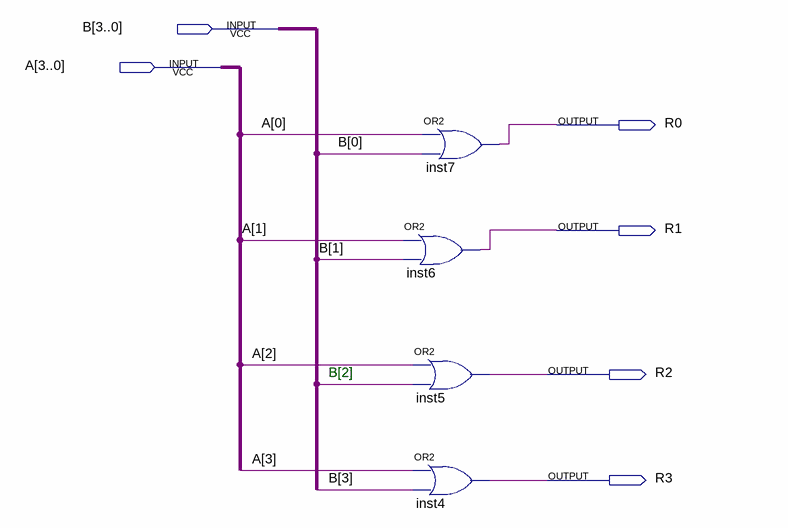
[diagram p0: schematic sheet]
// Quartus schematic ComOr.bdf as structural Verilog: 4 symbols, 6 pins
module ComOr (
  input  [3:0] B,
  input  [3:0] A,
  output R0,
  output R1,
  output R2,
  output R3
);

  or inst6 (R1, A[1], B[1]);
  or inst5 (R2, A[2], B[2]);
  or inst4 (R3, A[3], B[3]);
  or inst7 (R0, A[0], B[0]);

  // Notes on the sheet:
  //   B[2]
endmodule
